# Altium schematic sheet [18]-SP3_PMIC_BLOCK.SchDoc: RK3399 SOM Board Design V1.0
size A3; Author: ABC; Organization: Altium Limited; Address1: L3, 12a Rodborough Rd; Address2: Frenchs Forest; Address3: NSW; Address4: Australia 2086; DocumentNumber: 20; SheetNumber: 20; SheetTotal: 21; PROJECT CODE: A_V1.0
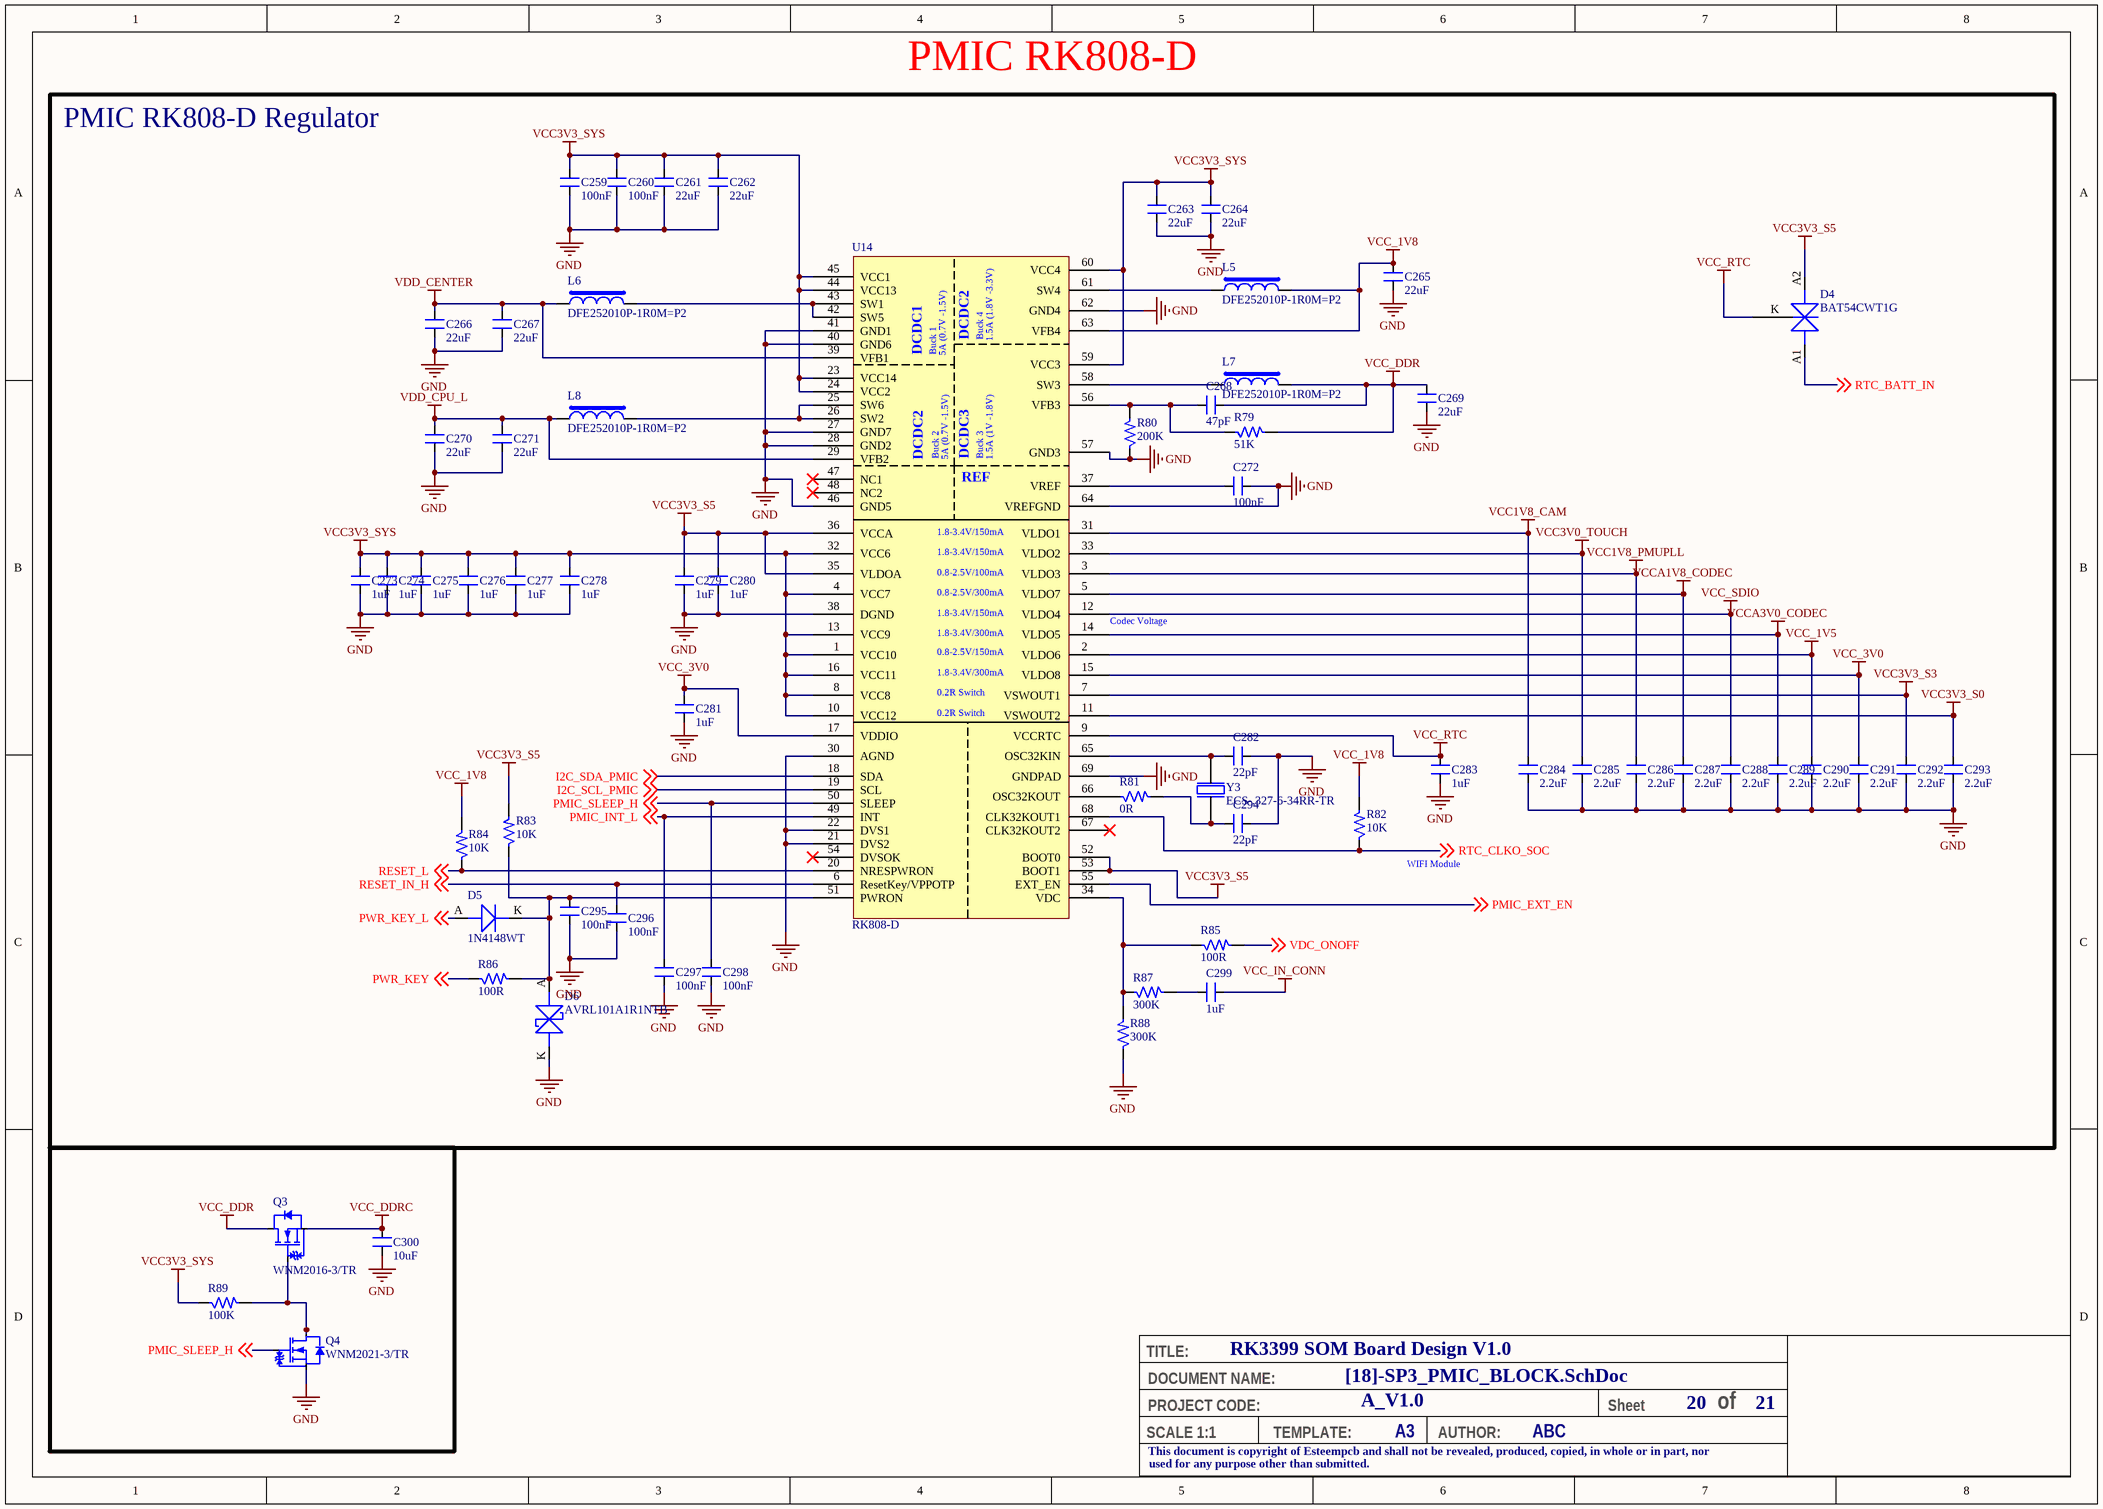
[diagram p0: [18]-SP3_PMIC_BLOCK.SchDoc]

## Parts
C259  100nF  [CAP_0402]
C260  100nF  [CAP_0402]
C261  22uF  [CAP_0603]
C262  22uF  [CAP_0603]
C263  22uF  [CAP_0603]
C264  22uF  [CAP_0603]
C265  22uF  [CAP_0603]
C266  22uF  [CAP_0603]
C267  22uF  [CAP_0603]
C268  47pF  [CAP_0402]
C269  22uF  [CAP_0603]
C270  22uF  [CAP_0603]
C271  22uF  [CAP_0603]
C272  100nF  [CAP_0402]
C273  1uF  [CAP_0402]
C274  1uF  [CAP_0402]
C275  1uF  [CAP_0402]
C276  1uF  [CAP_0402]
C277  1uF  [CAP_0402]
C278  1uF  [CAP_0402]
C279  1uF  [CAP_0402]
C280  1uF  [CAP_0402]
C281  1uF  [CAP_0402]
C282  22pF  [CAP_0402]
C283  1uF  [CAP_0402]
C284  2.2uF  [CAP_0402]
C285  2.2uF  [CAP_0402]
C286  2.2uF  [CAP_0402]
C287  2.2uF  [CAP_0402]
C288  2.2uF  [CAP_0402]
C289  2.2uF  [CAP_0402]
C290  2.2uF  [CAP_0402]
C291  2.2uF  [CAP_0402]
C292  2.2uF  [CAP_0402]
C293  2.2uF  [CAP_0402]
C294  22pF  [CAP_0402]
C295  100nF  [CAP_0402]
C296  100nF  [CAP_0402]
C297  100nF  [CAP_0402]
C298  100nF  [CAP_0402]
C299  1uF  [CAP_0402]
C300  10uF  [CAP_0402]
D4  BAT54CWT1G  [DIO_SOT-323-3]
D5  1N4148WT  [DIO_SOD523]
D6  AVRL101A1R1NTB  [DIO_0402_SMD]
L5  DFE252010P-1R0M=P2  [IND_1008]
L6  DFE252010P-1R0M=P2  [IND_1008]
L7  DFE252010P-1R0M=P2  [IND_1008]
L8  DFE252010P-1R0M=P2  [IND_1008]
Q3  WNM2016-3/TR  [SOT 23-3]
Q4  WNM2021-3/TR  [SOT-323-3]
R79  51K  [RES_0402]
R80  200K  [RES_0402]
R81  0R  [RES_0402]
R82  10K  [RES_0402]
R83  10K  [RES_0402]
R84  10K  [RES_0402]
R85  100R  [RES_0402]
R86  100R  [RES_0402]
R87  300K  [RES_0402]
R88  300K  [RES_0402]
R89  100K  [RES_0402]
U14  RK808-D  [QFN68_13.7_220.4X220.4_SMD]
Y3  ECS-.327-6-34RR-TR  [XTAL_ECS-.327-6-34RR-TR]

## Blocks framed on the sheet
PMIC RK808-D: C259-C299 D4-D6 L5-L8 R79-R88 U14 Y3

## Nets
GND: C259.1 C260.1 C261.1 C262.1 C263.1 C264.1 C265.1 C266.1 C267.1 C269.1 C270.1 C271.1 C272.1 C273.2 C274.1 C275.1 C276.1 C277.1 C278.1 C279.1 C280.1 C281.1 C282.2 C283.1 C284.1 C285.1 C286.1 C287.1 C288.1 C289.1 C290.1 C291.1 C292.1 C293.1 C294.2 C295.1 C296.1 C297.1 C298.1 C300.1 D6.K Q4.2(S) R80.1 R88.1 U14.21(DVS2) U14.22(DVS1) U14.27(GND7) U14.28(GND2) U14.30(AGND) U14.38(DGND) U14.40(GND6) U14.41(GND1) U14.46(GND5) U14.57(GND3) U14.62(GND4) U14.64(VREFGND) U14.69(GNDPAD)
VCC1V8_CAM: C284.2 U14.31(VLDO1)
VCC1V8_PMUPLL: C286.2 U14.3(VLDO3)
VCC3V0_TOUCH: C285.2 U14.33(VLDO2)
VCC3V3_S0: C293.2 U14.11(VSWOUT2)
VCC3V3_S3: C292.2 U14.7(VSWOUT1)
VCC3V3_S5: C279.2 C280.2 D4.A2 R83.2 U14.35(VLDOA) U14.36(VCCA) U14.52(BOOT0) U14.53(BOOT1)
VCC3V3_SYS: C259.2 C260.2 C261.2 C262.2 C263.2 C264.2 C273.1 C274.2 C275.2 C276.2 C277.2 C278.2 R89.1 U14.1(VCC10) U14.4(VCC7) U14.8(VCC8) U14.10(VCC12) U14.13(VCC9) U14.16(VCC11) U14.23(VCC14) U14.24(VCC2) U14.32(VCC6) U14.44(VCC13) U14.45(VCC1) U14.59(VCC3) U14.60(VCC4)
VCC_1V5: C290.2 U14.2(VLDO6)
VCC_1V8: C265.2 L5.2 R82.2 R84.2 U14.63(VFB4)
VCC_3V0: C281.2 C291.2 U14.15(VLDO8) U14.17(VDDIO)
VCC_DDR: C268.2 C269.2 L7.2 Q3.3(D) R79.2
VCC_DDRC: C300.2 Q3.2(S)
VCC_IN_CONN: C299.1
VCC_RTC: C283.2 D4.K U14.9(VCCRTC)
VCC_SDIO: C288.2 U14.12(VLDO4)
VCCA1V8_CODEC: C287.2 U14.5(VLDO7)
VCCA3V0_CODEC: C289.2 U14.14(VLDO5)
VDD_CENTER: C266.2 C267.2 L6.1 U14.39(VFB1)
VDD_CPU_L: C270.2 C271.2 L8.1 U14.29(VFB2)
I2C_SCL_PMIC: U14.19(SCL) ; off-sheet I2C_SCL_PMIC
I2C_SDA_PMIC: U14.18(SDA) ; off-sheet I2C_SDA_PMIC
PMIC_EXT_EN: U14.55(EXT_EN) ; off-sheet PMIC_EXT_EN
PMIC_INT_L: C297.2 U14.49(INT) ; off-sheet PMIC_INT_L
PMIC_SLEEP_H: C298.2 Q4.1(G) U14.50(SLEEP) ; off-sheet PMIC_SLEEP_H
PWR_KEY: R86.1 ; off-sheet PWR_KEY
PWR_KEY_L: D5.A(ANODE) ; off-sheet PWR_KEY_L
RESET_IN_H: C296.2 U14.6(ResetKey/VPPOTP) ; off-sheet RESET_IN_H
RESET_L: R84.1 U14.20(NRESPWRON) ; off-sheet RESET_L
RTC_BATT_IN: D4.A1 ; off-sheet RTC_BATT_IN
RTC_CLKO_SOC: R82.1 U14.68(CLK32KOUT1) ; off-sheet RTC_CLKO_SOC
VDC_ONOFF: R85.2 ; off-sheet VDC_ONOFF
NetC268_1: C268.1 R79.1 R80.2 U14.56(VFB3)
NetC272_2: C272.2 U14.37(VREF)
NetC282_1: C282.1 U14.65(OSC32KIN) Y3.2
NetC294_1: C294.1 R81.2 Y3.1
NetC295_2: C295.2 D5.K(CATHODE) D6.A R83.1 R86.2 U14.51(PWRON)
NetC299_2: C299.2 R87.2
NetL5_1: L5.1 U14.61(SW4)
NetL6_2: L6.2 U14.42(SW5) U14.43(SW1)
NetL7_1: L7.1 U14.58(SW3)
NetL8_2: L8.2 U14.25(SW6) U14.26(SW2)
NetQ3_1: Q3.1(G) Q4.3(D) R89.2
NetR81_1: R81.1 U14.66(OSC32KOUT)
NetR85_1: R85.1 R87.1 R88.2 U14.34(VDC)

Not connected (* = marked no-connect by the designer): U14 47(NC1)* 48(NC2)* 54(DVSOK)* 67(CLK32KOUT2)*

## Notes on the sheet
- PMIC RK808-D Regulator
- (near U14) Codec Voltage
- (near R82) WIFI Module
- TITLE:
- DOCUMENT NAME:
- SCALE 1:1
- This document is copyright of Esteempcb and shall not be revealed, produced, copied, in whole or in part, nor
- PROJECT CODE:
- TEMPLATE:
- A3
- AUTHOR:
- Sheet
- of
- used for any purpose other than submitted.
- (in symbol IC_RK808-D-QFN68) DCDC2; Buck 4; 1.5A (1.8V -3.3V); DCDC1; Buck 1; 5A (0.7V -1.5V); Buck 2; DCDC3; Buck 3; 1.5A (1V -1.8V); REF; 1.8-3.4V/150mA; 0.8-2.5V/100mA; 0.8-2.5V/300mA; 1.8-3.4V/300mA; 0.8-2.5V/150mA; 0.2R Switch

## Library data of the parts
C259 C260 C272 C295-C298 = CAP_100nF-25V-10%-0402: 0.1µF ±10% 25V Ceramic Capacitor X7R 0402 (1005 Metric) /; Manufacturer: Walsin Technology Corporation; Manufacturer Part Number: 0402B104K250CT; Case/Package: 0402; Supplier-1: Digikey
C261-C267 C269-C271 = CAP_22uF-10V-20%-0603: 22µF ±20% 10V Ceramic Capacitor X5R 0603 (1608 Metric) /; Manufacturer: Murata Electronics; Manufacturer Part Number: GRM188R61A226ME15D; Case/Package: 0603; Supplier-1: Digikey
C268 = CAP_47pF-10V-10%-0402: 47pF ±10% 10V Ceramic Capacitor C0G, NP0 0402 (1005 Metric) /; Manufacturer: KEMET; Manufacturer Part Number: C0402C470K8GAC7867; Case/Package: 0402; Supplier-1: Supplier-1
C273-C281 C283 C299 = CAP_1uF-16V-10%-0402: 1µF ±10% 16V Ceramic Capacitor X5R 0402 (1005 Metric) /; Manufacturer: Knowles Novacap; Manufacturer Part Number: 0402BW105K160YT; Case/Package: 0402; Supplier-1: Digikey
C282 C294 = CAP_22pF-10V-10%-0402: 22pF ±10% 10V Ceramic Capacitor C0G, NP0 0402 (1005 Metric) /; Manufacturer: KEMET; Manufacturer Part Number: C0402C220K8GACTU; Case/Package: 0402; Supplier-1: Digikey
C284-C293 = CAP_2.2uF-10V-10%-0402: 2.2µF ±10% 10V Ceramic Capacitor X5R 0402 (1005 Metric) /; Manufacturer: Murata Electronics; Manufacturer Part Number: GRM155R61A225KE95D; Case/Package: 0402; Supplier-1: Digikey
C300 = CAP_10uF-10V-20%-0402: 10µF ±20% 10V Ceramic Capacitor X5R 0402 (1005 Metric) /; Manufacturer Part Number: CL05A106MP5NUNC; Manufacturer: Samsung Electro-Mechanics; Case/Package: 0402; Supplier-1: Digikey
D4 = DIO-S-A_30V-200mA-SOT-323: Diode Array 1 Pair Common Cathode Schottky 30V 200mA (DC) Surface Mount SC-70, SOT-323; Manufacturer: ON Semiconductor; Manufacturer Part Number: BAT54CWT1G; Case/Package: SOT323; Supplier-1: Digikey
D5 = DIO_75V-200mA-SOD-523F: Diode Standard 100V 300mA (DC) Surface Mount SOD-123; Manufacturer: FAIRCHILD; Manufacturer Part Number: 1N4148WT; Case/Package: SOD123; Supplier-1: SIRICOM
D6 = DIO-T_10V-39V-0402: 39V Varistor 1 Circuit Surface Mount, MLCV 0402 (1005 Metric); Manufacturer: TDK Corporation; Manufacturer Part Number: AVRL101A1R1NTB; Supplier-1: Digikey; Case/Package: 0402
L5-L8 = IND_1uH-3.8A-20%-1008: 1µH Shielded Wirewound Inductor 3.8A 54mOhm Max 1008 (2520 Metric) /; Manufacturer: Murata Electronics; Manufacturer Part Number: DFE252010P-1R0M=P2; Case/Package: 1008; Supplier-1: Digikey
Q3 = MOSFET-N_20V-2.9A-SOT-23: N Channel 20V 2.9A 1V @ 250uA 47mΩ @ 3.6A,4.5V 700mW SOT-23(SOT-23-3) MOSFET RoHS /; Manufacturer: WILLSEMI(Will Semicon); Manufacturer Part Number: WNM2016-3/TR; Case/Package: SOT-23(SOT-23-3); Supplier-1: LCSC
Q4 = MOSFET-N_20V-820mA-SOT-323: N Channel 20V 820mA 850mV @ 250uA 310mΩ @ 550mA,4.5V 310mW SOT-323(SC-70) MOSFET RoHS /; Manufacturer: WILLSEMI(Will Semicon); Manufacturer Part Number: WNM2021-3/TR; Case/Package: SOT-323(SC-70); Supplier-1: LCSC
R79 = RES_51K-0.1W-1%-0402: 51 kOhms ±1% 0.1W, 1/10W Chip Resistor 0402 (1005 Metric) Automotive AEC-Q200 Thick Film /; Manufacturer: Panasonic Electronic Components; Manufacturer Part Number: ERJ-2RKF5102X; Case/Package: 0402; Supplier-1: Digikey
R80 = RES_200K-0.1W-1%-0402: 200 kOhms ±1% 0.1W, 1/10W Chip Resistor 0402 (1005 Metric) Automotive AEC-Q200 Thick Film /; Manufacturer: Panasonic Electronic Components; Manufacturer Part number: ERJ-2RKF2003X; Case/Package: 0402; Supplier-1: Digikey
R81 = RES_0R-0.1W-1%-0402: 0 Ohms Jumper 0.1W, 1/10W Chip Resistor 0402 (1005 Metric) Automotive AEC-Q200 Thick Film; Manufacturer: Panasonic Electronic Components; Manufacturer Part Number: ERJ-2GE0R00X; Case/Package: 0402; Supplier-1: Digikey
R82-R84 = RES_10K-0.1W-1%-0402: 10 kOhms ±1% 0.1W, 1/10W Chip Resistor 0402 (1005 Metric) Anti-Sulfur Thin Film /; Manufacturer: Vishay Beyschlag/Draloric/BC Components; Manufacturer Part Number: MCS04020C1002FE000; Case/Package: 0402; Supplier-1: Digikey
R85 R86 = RES_100R-0.1W-1%-0402: 100 Ohms ±1% 0.1W, 1/10W Chip Resistor 0402 (1005 Metric) Automotive AEC-Q200, Moisture Resistant Thick Film /; Manufacturer: KOA Speer Electronics, Inc.; Manufacturer Part Number: RK73H1ETTP1000F; Case/Package: 0402; Supplier-1: Digikey
R87 R88 = RES_300K-0.1W-1%-0402: 300 kOhms ±1% 0.1W, 1/10W Chip Resistor 0402 (1005 Metric) Automotive AEC-Q200 Thick Film /; Manufacturer: Panasonic Electronic Components; Manufacturer Part Number: ERJ-2RKF3003X; Case/Package: 0402; Supplier-1: Digikey
R89 = RES_100K-0.1W-1%-0402: 100 kOhms ±1% 0.1W, 1/10W Chip Resistor 0402 (1005 Metric) Anti-Sulfur Thin Film /; Manufacturer: Vishay Beyschlag/Draloric/BC Components; Manufacturer Part Number: MCS04020C1003FE000; Case/Package: 0402; Supplier-1: Digikey
U14 = IC_RK808-D-QFN68: The RK808 is a complete power supply solution for Portable systems.; Manufacturer: Rockchip; Manufacturer Part Number: RK808-D; Case/Package: QFN68; Supplier-1: Rockchip
Y3 = XTAL_32.768Khz-22pF-SMD: 32.768kHz ±20ppm Crystal 12pF 80 kOhms 2-SMD, No Lead /; Manufacturer: Ecliptek; Manufacturer Part Number: ECS-.327-6-34RR-TR; Case/Package: 0603; Supplier-1: Digikey